# Altium project MB1189.PrjPCB (part 2 of 3)

## Sheet MCU.SchDoc: MCU
size A3; Date: 9/24/2014; Author: P.A.; CompanyName: STMicroelectronics; Organization: Microcontrollers Division; Address1: 12, Rue Jules HOROWITZ; Address2: 38019 Grenoble; Address3: FRANCE; DocumentNumber: MB1189; Revision: B-07; SheetNumber: 4; SheetTotal: 13; Project: STM32F469I-DISCO
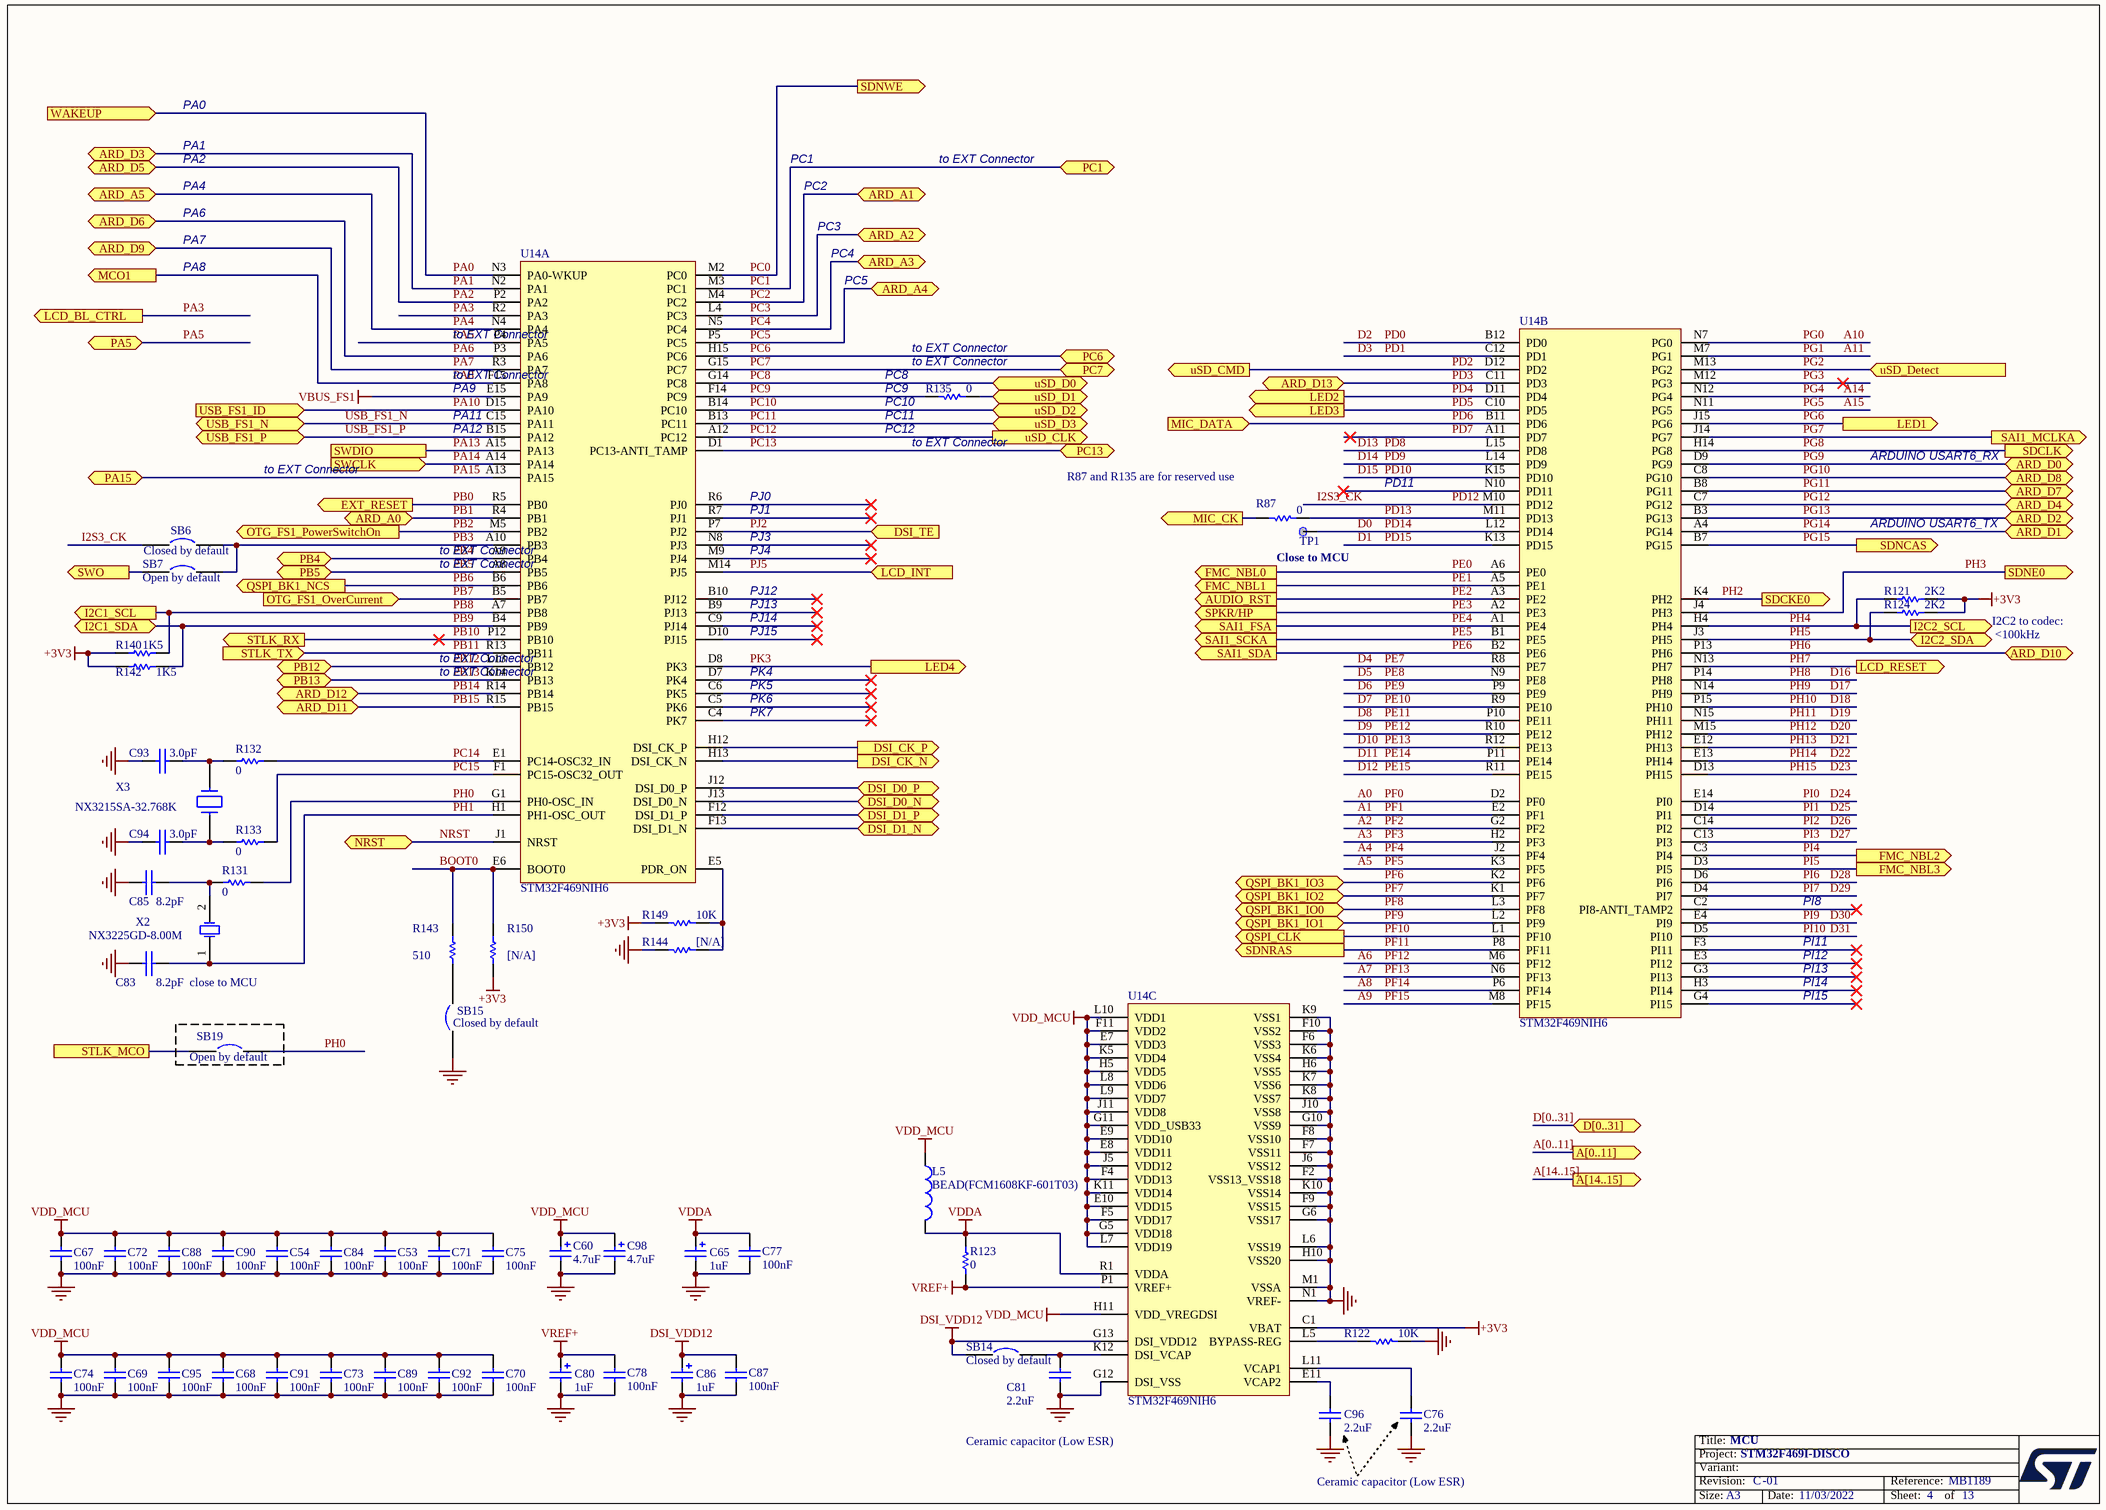
[diagram p6: MCU.SchDoc]

### Parts
C53  100nF  [0402C]
C54  100nF  [0402C]
C60  4.7uF  [CPOL_TAJ-A_1206_H180]
C65  1uF  [CPOL_TAJ-A_1206_H180]
C67  100nF  [0402C]
C68  100nF  [0402C]
C69  100nF  [0402C]
C70  100nF  [0402C]
C71  100nF  [0402C]
C72  100nF  [0402C]
C73  100nF  [0402C]
C74  100nF  [0402C]
C75  100nF  [0402C]
C76  2.2uF  [1206C]
C77  100nF  [0402C]
C78  100nF  [0402C]
C80  1uF  [CPOL_TAJ-A_1206_H180]
C81  2.2uF  [1206C]
C83  8.2pF  [0603C]
C84  100nF  [0402C]
C85  8.2pF  [0603C]
C86  1uF  [CPOL_TAJ-A_1206_H180]
C87  100nF  [0402C]
C88  100nF  [0402C]
C89  100nF  [0402C]
C90  100nF  [0402C]
C91  100nF  [0402C]
C92  100nF  [0402C]
C93  3.0pF  [0603C]
C94  3.0pF  [0603C]
C95  100nF  [0402C]
C96  2.2uF  [1206C]
C98  4.7uF  [CPOL_TAJ-A_1206_H180]
L5  BEAD(FCM1608KF-601T03)  [0603L]
R87  0  [0603R]
R121  2K2  [0603R]
R122  10K  [0402R]
R123  0  [0603R]
R124  2K2  [0603R]
R131  0  [0603R]
R132  0  [0603R]
R133  0  [0603R]
R135  0  [0603R]
R140  1K5  [0603R]
R142  1K5  [0603R]
R143  510  [0603R]
R144  [N/A]  [0603R]
R149  10K  [0402R]
R150  [N/A]  [0603R]
SB6  Closed by default  [SB_0603]
SB7  Open by default  [SB_0603]
SB14  Closed by default  [SB_0603]
SB15  Closed by default  [SB_0603]
SB19  Open by default  [SB_0603]
TP1  TP  [TP_C40]  (value not drawn)
U14  STM32F469NIH6  [BGA216_0R8_13X13]  (parts A,B,C of 3)
X2  NX3225GD-8.00M  [XTAL_2SM_3R2X2R5_H1]
X3  NX3215SA-32.768K  [XTAL_2SM_3R2X1R5]

### Ports
A[0..11] (out), A[14..15] (out), ARD_A0 (bidir), ARD_A1 (bidir), ARD_A2 (bidir), ARD_A3 (bidir), ARD_A4 (bidir), ARD_A5 (bidir), ARD_D0 (bidir), ARD_D1 (bidir), ARD_D2 (bidir), ARD_D3 (bidir), ARD_D4 (bidir), ARD_D5 (bidir), ARD_D6 (bidir), ARD_D7 (bidir), ARD_D8 (bidir), ARD_D9 (bidir), ARD_D10 (bidir), ARD_D11 (bidir), ARD_D12 (bidir), ARD_D13 (bidir), AUDIO_RST (out), D[0..31] (bidir), DSI_CK_N (out), DSI_CK_P (out), DSI_D0_N (bidir), DSI_D0_P (bidir), DSI_D1_N (bidir), DSI_D1_P (bidir), DSI_TE (in), EXT_RESET (out), FMC_NBL0 (out), FMC_NBL1 (out), FMC_NBL2 (out), FMC_NBL3 (out), I2C1_SCL (out), I2C1_SDA (bidir), I2C2_SCL (out), I2C2_SDA (bidir), LCD_BL_CTRL (out), LCD_INT (in), LCD_RESET (out), LED1 (out), LED2 (out), LED3 (out), LED4 (out), MCO1 (out), MIC_CK (out), MIC_DATA (in), NRST (bidir), OTG_FS1_OverCurrent (in), OTG_FS1_PowerSwitchOn (out), PA5 (bidir), PA15 (bidir), PB4 (bidir), PB5 (bidir), PB12 (bidir), PB13 (bidir), PC1 (bidir), PC6 (bidir), PC7 (bidir), PC13 (bidir), QSPI_BK1_IO0 (bidir), QSPI_BK1_IO1 (bidir), QSPI_BK1_IO2 (bidir), QSPI_BK1_IO3 (bidir), QSPI_BK1_NCS (out), QSPI_CLK (out), SAI1_FSA (out), SAI1_MCLKA (out), SAI1_SCKA (out), SAI1_SDA (out), SDCKE0 (out), SDCLK (out), SDNCAS (out), SDNE0 (out), SDNRAS (out), SDNWE (out), SPKR/HP (out), STLK_MCO, STLK_RX (out), STLK_TX (in), SWCLK (in), SWDIO, SWO (out), USB_FS1_ID (in), USB_FS1_N (bidir), USB_FS1_P (bidir), uSD_CLK (out), uSD_CMD (out), uSD_D0 (bidir), uSD_D1 (bidir), uSD_D2 (bidir), uSD_D3 (bidir), uSD_Detect (in), WAKEUP (in)

### Nets
+3V3: R121.1 R124.1 R140.1 R142.1 R149.2 R150.2 U14.C1(VBAT)
DSI_VDD12: C86.1 C87.2 SB14.1 U14.G13(DSI_VDD12)
GND: C53.2 C54.2 C60.2 C65.2 C67.2 C68.2 C69.2 C70.2 C71.2 C72.2 C73.2 C74.2 C75.2 C76.2 C77.1 C78.1 C80.2 C81.2 C83.2 C84.2 C85.2 C86.2 C87.1 C88.2 C89.2 C90.2 C91.2 C92.2 C93.2 C94.2 C95.2 C96.2 C98.2 R122.1 R144.2 SB15.1 U14.F2(VSS13_VSS18) U14.F6(VSS3) U14.F7(VSS11) U14.F8(VSS10) U14.F9(VSS15) U14.F10(VSS2) U14.G6(VSS17) U14.G10(VSS9) U14.G12(DSI_VSS) U14.H6(VSS5) U14.H10(VSS20) U14.J6(VSS12) U14.J10(VSS8) U14.K6(VSS4) U14.K7(VSS6) U14.K8(VSS7) U14.K9(VSS1) U14.K10(VSS14) U14.L6(VSS19) U14.M1(VSSA) U14.N1(VREF-)
VBUS_FS1: U14.E15(PA9)
VDD_MCU: C53.1 C54.1 C60.1 C67.1 C68.1 C69.1 C70.1 C71.1 C72.1 C73.1 C74.1 C75.1 C84.1 C88.1 C89.1 C90.1 C91.1 C92.1 C95.1 C98.1 L5.1 U14.E7(VDD3) U14.E8(VDD11) U14.E9(VDD10) U14.E10(VDD15) U14.F4(VDD13) U14.F5(VDD17) U14.F11(VDD2) U14.G5(VDD18) U14.G11(VDD_USB33) U14.H5(VDD5) U14.H11(VDD_VREGDSI) U14.J5(VDD12) U14.J11(VDD8) U14.K5(VDD4) U14.K11(VDD14) U14.L7(VDD19) U14.L8(VDD6) U14.L9(VDD7) U14.L10(VDD1)
VDDA: C65.1 C77.2 L5.2 R123.1 U14.R1(VDDA)
VREF+: C78.2 C80.1 R123.2 U14.P1(VREF+)
A0: U14.D2(PF0)  [also labelled PF0]
A1: U14.E2(PF1)  [also labelled PF1]
A2: U14.G2(PF2)  [also labelled PF2]
A3: U14.H2(PF3)  [also labelled PF3]
A4: U14.J2(PF4)  [also labelled PF4]
A5: U14.K3(PF5)  [also labelled PF5]
A6: U14.M6(PF12)  [also labelled PF12]
A7: U14.N6(PF13)  [also labelled PF13]
A8: U14.P6(PF14)  [also labelled PF14]
A9: U14.M8(PF15)  [also labelled PF15]
A10: U14.N7(PG0)  [also labelled PG0]
A11: U14.M7(PG1)  [also labelled PG1]
A14: U14.N12(PG4)  [also labelled PG4]
A15: U14.N11(PG5)  [also labelled PG5]
BOOT0: R143.1 R150.1 U14.E6(BOOT0)
D0: TP1.1 U14.L12(PD14)  [also labelled PD14]
D1: U14.K13(PD15)  [also labelled PD15]
D2: U14.B12(PD0)  [also labelled PD0]
D3: U14.C12(PD1)  [also labelled PD1]
D4: U14.R8(PE7)  [also labelled PE7]
D5: U14.N9(PE8)  [also labelled PE8]
D6: U14.P9(PE9)  [also labelled PE9]
D7: U14.R9(PE10)  [also labelled PE10]
D8: U14.P10(PE11)  [also labelled PE11]
D9: U14.R10(PE12)  [also labelled PE12]
D10: U14.R12(PE13)  [also labelled PE13]
D11: U14.P11(PE14)  [also labelled PE14]
D12: U14.R11(PE15)  [also labelled PE15]
D13: U14.L15(PD8)  [also labelled PD8]
D14: U14.L14(PD9)  [also labelled PD9]
D15: U14.K15(PD10)  [also labelled PD10]
D16: U14.P14(PH8)  [also labelled PH8]
D17: U14.N14(PH9)  [also labelled PH9]
D18: U14.P15(PH10)  [also labelled PH10]
D19: U14.N15(PH11)  [also labelled PH11]
D20: U14.M15(PH12)  [also labelled PH12]
D21: U14.E12(PH13)  [also labelled PH13]
D22: U14.E13(PH14)  [also labelled PH14]
D23: U14.D13(PH15)  [also labelled PH15]
D24: U14.E14(PI0)  [also labelled PI0]
D25: U14.D14(PI1)  [also labelled PI1]
D26: U14.C14(PI2)  [also labelled PI2]
D27: U14.C13(PI3)  [also labelled PI3]
D28: U14.D6(PI6)  [also labelled PI6]
D29: U14.D4(PI7)  [also labelled PI7]
D30: U14.E4(PI9)  [also labelled PI9]
D31: U14.D5(PI10)  [also labelled PI10]
HSSI_CLK_N: U14.H13(DSI_CK_N) ; port DSI_CK_N
HSSI_CLK_P: U14.H12(DSI_CK_P) ; port DSI_CK_P
HSSI_D0_N: U14.J13(DSI_D0_N) ; port DSI_D0_N
HSSI_D0_P: U14.J12(DSI_D0_P) ; port DSI_D0_P
HSSI_D1_N: U14.F13(DSI_D1_N) ; port DSI_D1_N
HSSI_D1_P: U14.F12(DSI_D1_P) ; port DSI_D1_P
I2S3_CK: SB6.1 U14.M10(PD12)  [also labelled PD12]
MIC_CK: R87.1 ; port MIC_CK
NRST: U14.J1(NRST) ; port NRST
PA0: U14.N3(PA0-WKUP) ; port WAKEUP
PA1: U14.N2(PA1) ; port ARD_D3
PA2: U14.P2(PA2) ; port ARD_D5
PA3: U14.R2(PA3) ; port LCD_BL_CTRL  [project net LCD_BL_CTRL]
PA4: U14.N4(PA4) ; port ARD_A5
PA5: U14.P4(PA5) ; port PA5
PA6: U14.P3(PA6) ; port ARD_D6
PA7: U14.R3(PA7) ; port ARD_D9
PA8: U14.F15(PA8) ; port MCO1
PA10: U14.D15(PA10) ; port USB_FS1_ID
PA13: U14.A15(PA13) ; port SWDIO
PA14: U14.A14(PA14) ; port SWCLK
PA15: U14.A13(PA15) ; port PA15
PB0: U14.R5(PB0) ; port EXT_RESET
PB1: U14.R4(PB1) ; port ARD_A0
PB2: U14.M5(PB2) ; port OTG_FS1_PowerSwitchOn
PB3: SB6.2 SB7.2 U14.A10(PB3)
PB4: U14.A9(PB4) ; port PB4
PB5: U14.A8(PB5) ; port PB5
PB6: U14.B6(PB6) ; port QSPI_BK1_NCS
PB7: U14.B5(PB7) ; port OTG_FS1_OverCurrent
PB8: R140.2 U14.A7(PB8) ; port I2C1_SCL  [project net I2C1_SCL]
PB9: R142.2 U14.B4(PB9) ; port I2C1_SDA  [project net I2C1_SDA]
PB10: U14.P12(PB10) ; port STLK_RX
PB11: U14.R13(PB11) ; port STLK_TX
PB12: U14.L13(PB12) ; port PB12
PB13: U14.K14(PB13) ; port PB13
PB14: U14.R14(PB14) ; port ARD_D12
PB15: U14.R15(PB15) ; port ARD_D11
PC0: U14.M2(PC0) ; port SDNWE
PC1: U14.M3(PC1) ; port PC1
PC2: U14.M4(PC2) ; port ARD_A1
PC3: U14.L4(PC3) ; port ARD_A2
PC4: U14.N5(PC4) ; port ARD_A3
PC5: U14.P5(PC5) ; port ARD_A4
PC6: U14.H15(PC6) ; port PC6
PC7: U14.G15(PC7) ; port PC7
PC8: U14.G14(PC8) ; port uSD_D0
PC9: R135.1 U14.F14(PC9)
PC10: U14.B14(PC10) ; port uSD_D2
PC11: U14.B13(PC11) ; port uSD_D3
PC12: U14.A12(PC12) ; port uSD_CLK
PC13: U14.D1(PC13-ANTI_TAMP) ; port PC13
PC14: R132.2 U14.E1(PC14-OSC32_IN)
PC15: R133.2 U14.F1(PC15-OSC32_OUT)
PD2: U14.D12(PD2) ; port uSD_CMD
PD3: U14.C11(PD3) ; port ARD_D13
PD4: U14.D11(PD4) ; port LED2
PD5: U14.C10(PD5) ; port LED3
PD6: U14.B11(PD6) ; port MIC_DATA
PD7: U14.A11(PD7)
PD13: R87.2 U14.M11(PD13)
PE0: U14.A6(PE0) ; port FMC_NBL0
PE1: U14.A5(PE1) ; port FMC_NBL1
PE2: U14.A3(PE2) ; port AUDIO_RST  [project net AUDIO_RST]
PE3: U14.A2(PE3) ; port SPKR/HP
PE4: U14.A1(PE4) ; port SAI1_FSA
PE5: U14.B1(PE5) ; port SAI1_SCKA
PE6: U14.B2(PE6) ; port SAI1_SDA
PF6: U14.K2(PF6) ; port QSPI_BK1_IO3
PF7: U14.K1(PF7) ; port QSPI_BK1_IO2
PF8: U14.L3(PF8) ; port QSPI_BK1_IO0
PF9: U14.L2(PF9) ; port QSPI_BK1_IO1
PF10: U14.L1(PF10) ; port QSPI_CLK
PF11: U14.P8(PF11) ; port SDNRAS
PG2: U14.M13(PG2) ; port uSD_Detect
PG3: U14.M12(PG3)
PG6: U14.J15(PG6) ; port LED1
PG7: U14.J14(PG7) ; port SAI1_MCLKA
PG8: U14.H14(PG8) ; port SDCLK
PG9: U14.D9(PG9) ; port ARD_D0
PG10: U14.C8(PG10) ; port ARD_D8
PG11: U14.B8(PG11) ; port ARD_D7
PG12: U14.C7(PG12) ; port ARD_D4
PG13: U14.B3(PG13) ; port ARD_D2
PG14: U14.A4(PG14) ; port ARD_D1
PG15: U14.B7(PG15) ; port SDNCAS
PH0: R131.1 SB19.2 U14.G1(PH0-OSC_IN)
PH1: C83.1 U14.H1(PH1-OSC_OUT) X2.1(OSC1)
PH2: U14.K4(PH2) ; port SDCKE0
PH3: U14.J4(PH3) ; port SDNE0
PH4: R121.2 U14.H4(PH4) ; port I2C2_SCL  [project net I2C2_SCL]
PH5: R124.2 U14.J3(PH5) ; port I2C2_SDA  [project net I2C2_SDA]
PH6: U14.P13(PH6) ; port ARD_D10
PH7: U14.N13(PH7) ; port LCD_RESET  [project net LCD_RST]
PI4: U14.C3(PI4) ; port FMC_NBL2
PI5: U14.D3(PI5) ; port FMC_NBL3
PJ2: U14.P7(PJ2) ; port DSI_TE
PJ5: U14.M14(PJ5) ; port LCD_INT  [project net LCD_INT]
PK3: U14.D8(PK3) ; port LED4
STLK_MCO: SB19.1 ; port STLK_MCO
SWO: SB7.1 ; port SWO
USB_FS1_N: U14.C15(PA11) ; port USB_FS1_N
USB_FS1_P: U14.B15(PA12) ; port USB_FS1_P
uSD_D1: R135.2 ; port uSD_D1
NetC76_1: C76.1 U14.L11(VCAP1)
NetC81_1: C81.1 SB14.2 U14.K12(DSI_VCAP)
NetC85_1: C85.1 R131.2 X2.2(OSC2)
NetC93_1: C93.1 R132.1 X3.1
NetC94_1: C94.1 R133.1 X3.2
NetC96_1: C96.1 U14.E11(VCAP2)
NetR122_2: R122.2 U14.L5(BYPASS-REG)
NetR143_2: R143.2 SB15.2
NetR144_1: R144.1 R149.1 U14.E5(PDR_ON)

Not connected (* = marked no-connect by the designer): U14 B9(PJ13)* B10(PJ12)* C2(PI8-ANTI_TAMP2)* C4(PK7)* C5(PK6)* C6(PK5)* C9(PJ14)* D7(PK4)* D10(PJ15)* E3(PI12)* F3(PI11)* G3(PI13)* G4(PI15)* H3(PI14)* M9(PJ4)* N8(PJ3)* N10(PD11)* R6(PJ0)* R7(PJ1)*

### Buses and harness runs
bus A[0..11] = port A[0..11]
bus A[14..15] = port A[14..15]
bus D[0..31] = port D[0..31]

### Notes on the sheet
- PA0
- PA1
- PA2
- PC1
- to EXT Connector
- PA6
- PA7
- PA4
- PC2
- PC3
- PA8
- PC4
- PC5
- (near R135) PC8
- (near R135) to EXT Connector
- (near U14) PA11
- (near U14) PA12
- (near U14) PA9
- (near R135) PC9
- (near R135) PC10
- (near R135) PC11
- (near R135) PC12
- PJ1
- PJ0
- (near R87) R87 and R135 are for reserved use
- PD11
- ARDUINO USART6_RX
- PJ4
- PJ3
- Close to MCU
- ARDUINO USART6_TX
- PJ15
- PJ13
- PJ12
- PJ14
- I2C2 to codec:
  <100kHz
- PK7
- PK6
- PK5
- PK4
- PI8
- close to MCU
- PI14
- PI13
- PI12
- PI11
- PI15
- Ceramic capacitor (Low ESR)
- Title:
- Project:
- Size:
- Revision:
- Variant:
- A3
- -
- Date:
- Reference:
- Sheet:
- of

### Library data of the parts
C53 C67-C75 C84 C88-C92 C95 = CAP: Capacitor; Manuf_part_1: CC0402KRX7R7BB104; Manuf_1: YAGEO; Ordered by: Subcon; Published: 8-Jun-2000; Revision: July-2002: Re-released for DXP Platform.; Publisher: Altium Limited; Value: 100nF
C54 = CAP: Capacitor; Manuf_Part_1: CC0402KRX7R7BB104; Manuf_1: YAGEO; Ordered by: Subcon; Published: 8-Jun-2000; Revision: July-2002: Re-released for DXP Platform.; Publisher: Altium Limited; Value: 100nF
C60 C98 = Cap_TAJA475K016R: Capacitor, Tantalum, 4.7uF, 16V, 10%, 4ohms, pkg Type_A (3216 metric), T=1.6mm; Manuf_1: AVX; Value: 4.7uF 16V; Revision: July-2002: Re-released for DXP Platform.; Manuf_part_1: TAJA475K016R
C65 C80 C86 = Cap_TAJA105K016RNJ: Capacitor, Tantalum, 1uF, 16V, 10%, 11Ohms, pkg Type_A (3216 metric), T=1.6mm; Manuf_1: AVX; Value: 1uF (16V); Revision: July-2002: Re-released for DXP Platform.; Manuf_part_1: TAJA105K016RNJ
C76 = Cap: Capacitor; Manuf_1: YAGEO; Manuf_part_1: CC1206KKX7R7BB225; Ordered by: Subcon; Published: 8-Jun-2000; Revision: July-2002: Re-released for DXP Platform.; Publisher: Altium Limited; Value: 2.2uF
C77 C78 C87 = Cap: Capacitor; Manuf_part_1: CC0402KRX7R7BB104; Manuf_1: YAGEO; Ordered by: Subcon; Published: 8-Jun-2000; Revision: July-2002: Re-released for DXP Platform.; Publisher: Altium Limited; Value: 100nF
C81 C96 = Cap: Capacitor; Manuf_part_1: CC1206KKX7R7BB225; Manuf_1: YAGEO; Ordered by: Subcon; Published: 8-Jun-2000; Revision: July-2002: Re-released for DXP Platform.; Publisher: Altium Limited; Value: 2.2uF
C83 C85 = CAP: Capacitor; Manuf_part_1: CC0603CRNPO9BN8R2; Manuf_1: YAGEO; Ordered by: Subcon; Value: 8.2pF
C93 C94 = CAP: Capacitor; Manuf_1: YAGEO; Manuf_part_1: CC0603CRNPO9BN3R0; Ordered by: Subcon
  C93: Value: 3.0pF
  C94: value: 3.0pF
L5 = Inductor: Manuf_1: Tai-Tech Advanced Electronics; Manuf_part_1: FCM1608KF-601T05; Value: 100uH; Ordered by: Subcon; Published: 8-Jun-2000; Revision: July-2002: Re-released for DXP Platform.; Publisher: Altium Limited
R87 R123 R131-R133 R135 = Res1: Resistor; Manuf_1: YAGEO; Manuf_part_1: RC0603JR-070RL; Ordered by: Subcon; Published: 8-Jun-2000; Revision: July-2002: Re-released for DXP Platform.; Publisher: Altium Limited; Value: 0
R121 R124 = Res1: Resistor; Manuf_1: YAGEO; Manuf_part_1: RC0603FR-072K2L; Ordered by: Subcon; Published: 8-Jun-2000; Revision: July-2002: Re-released for DXP Platform.; Publisher: Altium Limited
  R121: Value: 2K2
  R124: Value: 2k2
R122 R149 = Res1: Resistor; Manuf_1: YAGEO; Manuf_part_1: RC0402FR-0710KL; Ordered by: Subcon; Published: 8-Jun-2000; Revision: July-2002: Re-released for DXP Platform.; Publisher: Altium Limited; Value: 10K
R140 R142 = Res1: Resistor; Manuf_1: YAGEO; Manuf_part_1: RC0603FR-071K5L; Ordered by: Subcon; Published: 8-Jun-2000; Revision: July-2002: Re-released for DXP Platform.; Publisher: Altium Limited; Value: 1K5
R143 = res1: Resistor; Manuf_1: YAGEO; Manuf_part_1: RC0603FR-07510RL; Ordered by: Subcon; Published: 8-Jun-2000; Revision: July-2002: Re-released for DXP Platform.; Publisher: Altium Limited; Value: 510
R144 = Res1: Resistor; Value: 1K; Ordered by: Subcon; Fitted: NO; Published: 8-Jun-2000; Revision: July-2002: Re-released for DXP Platform.; Publisher: Altium Limited
R150 = res1: Resistor; Value: 1K; Ordered by: Subcon; Fitted: NO; Published: 8-Jun-2000; Revision: July-2002: Re-released for DXP Platform.; Publisher: Altium Limited
SB6 SB14 SB15 = Circuit Breaker: Ordered by: Subcon; Comments: Solder bridge; Published: 24-Mar-1999; Revision: July-2002: Re-released for DXP Platform.; Publisher: Altium Limited
  SB6: ECCN_US/EU: n/a
SB7 SB19 = Circuit Breaker: Ordered by: Subcon; Comments: Solder bridge; Solder: NO; Published: 24-Mar-1999; Revision: July-2002: Re-released for DXP Platform.; Publisher: Altium Limited
TP1 = TP: Ordered by: Subcon
U14 = Manta_Dragon_TFBGA216: Manuf_Part_1: STM32F469NIH6U cut 1.0; Ordered by: ST; Ref St: 9175177; ECCN_US/EU: 3A991A2/NEC; Manuf_1: ST
X2 = XTAL_8M_NX3225GD: Crystal 8Mhz, 8pF, -+50PPM, SMD; Manuf_1: NDK; Manuf_Part_1: NX3225GD 8MHz EXS00A-CG04874; Manuf_Part_2: NX3225GD-8.000M-STD-CRA-3; ECCN_US/EU: EAR99/NEC; NDK Ref: X3127326; Ref St: 9157029; Provided: ST; Order: NX3225GD 8MHz EXS00A-CG04874; Ordered by: ST
X3 = XTAL_32K_NX3215SA: Crystal 32.768kHz, 6pF, -+20PPM, R=50K, SMD; Manuf_1: NDK; Manuf_Part_1: NX3215SA 32.768KHz EXS00A-MU00525; ECCN_US/EU: EAR99/NEC; Ref St: 9157034; NDK Ref: X3101802; Provided: ST; Distrib: *; Order: NX3215SA 32.768KHz EXS00A-MU00525; Ordered by: ST

## Sheet Arduino_ Connectors.SchDoc: Arduino Uno connector
size A4; Date: 9/24/2014; Author: P.A.; CompanyName: STMicroelectronics; Organization: Microcontrollers Division; Address1: 12, Rue Jules HOROWITZ; Address2: 38019 Grenoble; Address3: FRANCE; DocumentNumber: MB1189; Revision: B-07; SheetNumber: 12; SheetTotal: 13; Project: STM32F469I-DISCO
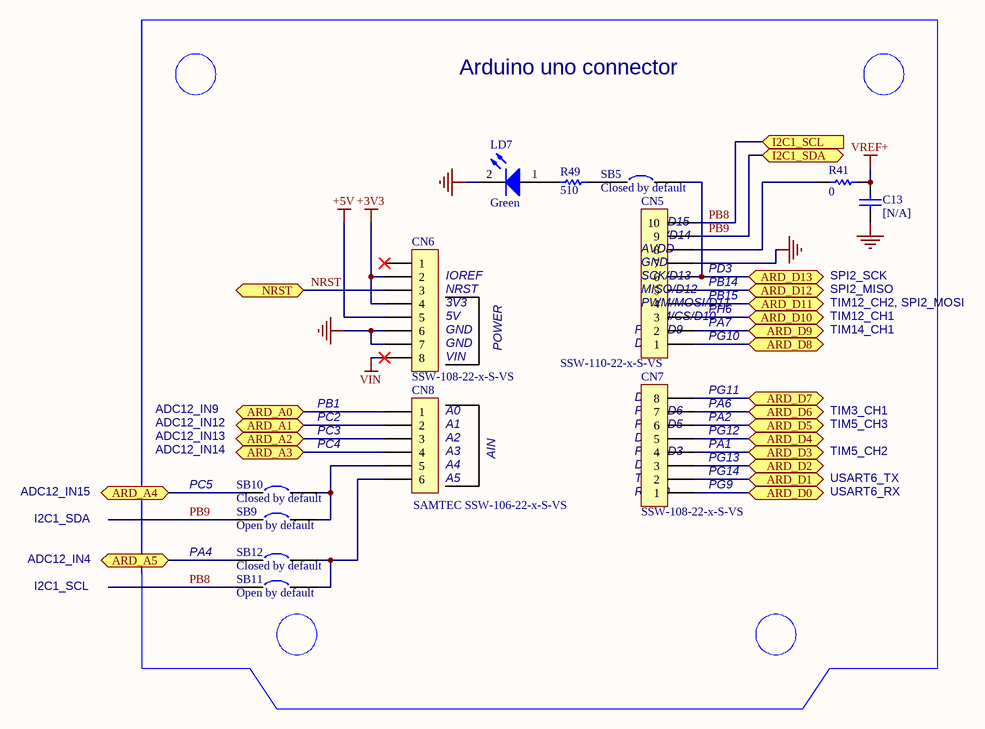
[diagram p7: Arduino_ Connectors.SchDoc]

### Parts
C13  [N/A]  [0603C]
CN5  SSW-110-22-x-S-VS  [SSW-110-22-X-S-VS]
CN6  SSW-108-22-x-S-VS  [SSW-108-22-X-S-VS]
CN7  SSW-108-22-x-S-VS  [SSW-108-22-X-S-VS]
CN8  SAMTEC SSW-106-22-x-S-VS  [SSW-106-22-X-S-VS]
LD7  Green  [0603D]
R41  0  [0603R]
R49  510  [0603R]
SB5  Closed by default  [SB_0603]
SB9  Open by default  [SB_0603]
SB10  Closed by default  [SB_0603]
SB11  Open by default  [SB_0603]
SB12  Closed by default  [SB_0603]

### Ports
ARD_A0 (bidir), ARD_A1 (bidir), ARD_A2 (bidir), ARD_A3 (bidir), ARD_A4 (bidir), ARD_A5 (bidir), ARD_D0 (bidir), ARD_D1 (bidir), ARD_D2 (bidir), ARD_D3 (bidir), ARD_D4 (bidir), ARD_D5 (bidir), ARD_D6 (bidir), ARD_D7 (bidir), ARD_D8 (bidir), ARD_D9 (bidir), ARD_D10 (bidir), ARD_D11 (bidir), ARD_D12 (bidir), ARD_D13 (bidir), I2C1_SCL (in), I2C1_SDA (bidir), NRST (bidir)

### Nets
+3V3: CN6.2 CN6.4
+5V: CN6.5
GND: C13.1 CN5.7 CN6.6 CN6.7 LD7.2(K)
VIN: CN6.8
VREF+: C13.2 R41.1
NRST: CN6.3 ; port NRST
PA1: CN7.4 ; port ARD_D3
PA2: CN7.6 ; port ARD_D5
PA4: SB12.1 ; port ARD_A5
PA6: CN7.7 ; port ARD_D6
PA7: CN5.2 ; port ARD_D9
PB1: CN8.1 ; port ARD_A0
PB8: CN5.10 SB11.1 ; port I2C1_SCL  [project net I2C1_SCL]
PB9: CN5.9 SB9.1 ; port I2C1_SDA  [project net I2C1_SDA]
PB14: CN5.5 ; port ARD_D12
PB15: CN5.4 ; port ARD_D11
PC2: CN8.2 ; port ARD_A1
PC3: CN8.3 ; port ARD_A2
PC4: CN8.4 ; port ARD_A3
PC5: SB10.1 ; port ARD_A4
PD3: CN5.6 SB5.2 ; port ARD_D13
PG9: CN7.1 ; port ARD_D0
PG10: CN5.1 ; port ARD_D8
PG11: CN7.8 ; port ARD_D7
PG12: CN7.5 ; port ARD_D4
PG13: CN7.3 ; port ARD_D2
PG14: CN7.2 ; port ARD_D1
PH6: CN5.3 ; port ARD_D10
NetCN5_8: CN5.8 R41.2
NetCN8_5: CN8.5 SB9.2 SB10.2
NetCN8_6: CN8.6 SB11.2 SB12.2
NetLD7_1: LD7.1(A) R49.2
NetR49_1: R49.1 SB5.1

Not connected (* = marked no-connect by the designer): CN6 1*

### Notes on the sheet
- Arduino uno connector
- (near CN5) SDA/D14
- SCL/D15
- (near CN5) AVDD
- (near CN6) IOREF
- (near CN6) NRST
- (near CN6) 3V3
- (near CN5) SCK/D13
- (near CN5) MISO/D12
- (near CN5) PWM/MOSI/D11
- (near CN5) GND
- (near CN5) PH6
- (near CN5) PB15
- (near CN5) PB14
- (near CN5) PD3
- TIM12_CH2, SPI2_MOSI
- SPI2_MISO
- SPI2_SCK
- (near CN6) 5V
- (near CN6) GND
- (near CN6) VIN
- POWER
- (near CN5) D8
- (near CN5) PWM/D9
- (near CN5) PWM/CS/D10
- (near CN5) PG10
- (near CN5) PA7
- TIM14_CH1
- TIM12_CH1
- ADC12_IN14
- ADC12_IN13
- ADC12_IN12
- ADC12_IN9
- PB1
- PC2
- PC3
- PC4
- (near CN8) A0
- (near CN8) A1
- (near CN8) A2
- (near CN7) D4
- (near CN7) PWM/D5
- (near CN7) PWM/D6
- (near CN7) D7
- (near CN7) PA1
- (near CN7) PG12
- (near CN7) PA2
- (near CN7) PA6
- PG11
- TIM5_CH3
- TIM3_CH1
- ADC12_IN15
- I2C1_SDA
- PC5
- (near CN8) A3
- (near CN8) A4
- (near CN8) A5
- AIN
- (near CN7) RX/D0
- (near CN7) TX/D1
- (near CN7) D2
- (near CN7) PWM/D3
- (near CN7) PG9
- (near CN7) PG14
- (near CN7) PG13
- USART6_RX
- USART6_TX
- TIM5_CH2
- ADC12_IN4
- PA4
- I2C1_SCL
- Title:
- Project:
- Size:
- Revision:
- Variant:
- -
- Date:
- Reference:
- Sheet:
- of

### Library data of the parts
C13 = Cap: Capacitor; Value: 10nF; Ordered by: Subcon; Fitted: NO; Published: 8-Jun-2000; Revision: July-2002: Re-released for DXP Platform.; Publisher: Altium Limited
CN5 = Header 10X1_Female: Header, 10-Pin, Single row,female; Manuf_1: SAMTEC; Ordered by: Subcon; Silkscreen: pin names as in schematic; LatestRevisionDate: 17-Jul-2002; LatestRevisionNote: Re-released for DXP Platform.; Publisher: Altium Limited; Manuf_Part_1: SSW-110-22-x-S-VS
CN6 CN7 = Header 8X1_Female: Header, 8-Pin, Single row,female; Manuf_1: SAMTEC; Ordered by: Subcon; Silkscreen: pin names as in schematic; LatestRevisionDate: 17-Jul-2002; LatestRevisionNote: Re-released for DXP Platform.; Publisher: Altium Limited; Manuf_Part_1: SSW-108-22-x-S-VS
CN8 = Header 6X1_Female: Header, 6-Pin, Single row,female SMD; Ordered by: Subcon; Silkscreen: pin names as in schematic; LatestRevisionDate: 17-Jul-2002; LatestRevisionNote: Re-released for DXP Platform.; Publisher: Altium Limited; Manuf_1: SAMTEC; Manuf_Part_1: SSW-106-22-x-S-VS
LD7 = LED2: Typical RED, GREEN, YELLOW, AMBER GaAs LED; Manuf_1: Everlight Electronics; Manuf_part_1: 19-217/G7C-AN1P2/3T; Ordered by: Subcon; ECCN_US/EU: EAR99/NEC; Published: 8-Jun-2000; Revision: July-2002: Re-released for DXP Platform.; Publisher: Altium Limited
R41 = Res1: as R87 on sheet MCU; Published: 8-Jun-2000; Revision: July-2002: Re-released for DXP Platform.; Publisher: Altium Limited; Value: 0
R49 = Res1: Resistor; Manuf_1: YAGEO; Manuf_part_1: RC0603FR-07510RL; Ordered by: Subcon; Published: 8-Jun-2000; Revision: July-2002: Re-released for DXP Platform.; Publisher: Altium Limited; Value: 510
SB5 SB10 SB12 = Circuit Breaker: as SB6 on sheet MCU; Published: 24-Mar-1999; Revision: July-2002: Re-released for DXP Platform.; Publisher: Altium Limited
SB9 SB11 = Circuit Breaker: as SB7 on sheet MCU; Published: 24-Mar-1999; Revision: July-2002: Re-released for DXP Platform.; Publisher: Altium Limited

## Sheet DSI_LCD.SchDoc: 4 inch DSI LCD board
size A4; Date: 9/24/2014; Author: P.A.; CompanyName: STMicroelectronics; Organization: Microcontrollers Division; Address1: 12, Rue Jules HOROWITZ; Address2: 38019 Grenoble; Address3: FRANCE; DocumentNumber: MB1189; Revision: B-07; SheetNumber: 7; SheetTotal: 13; Project: STM32F469I-DISCO
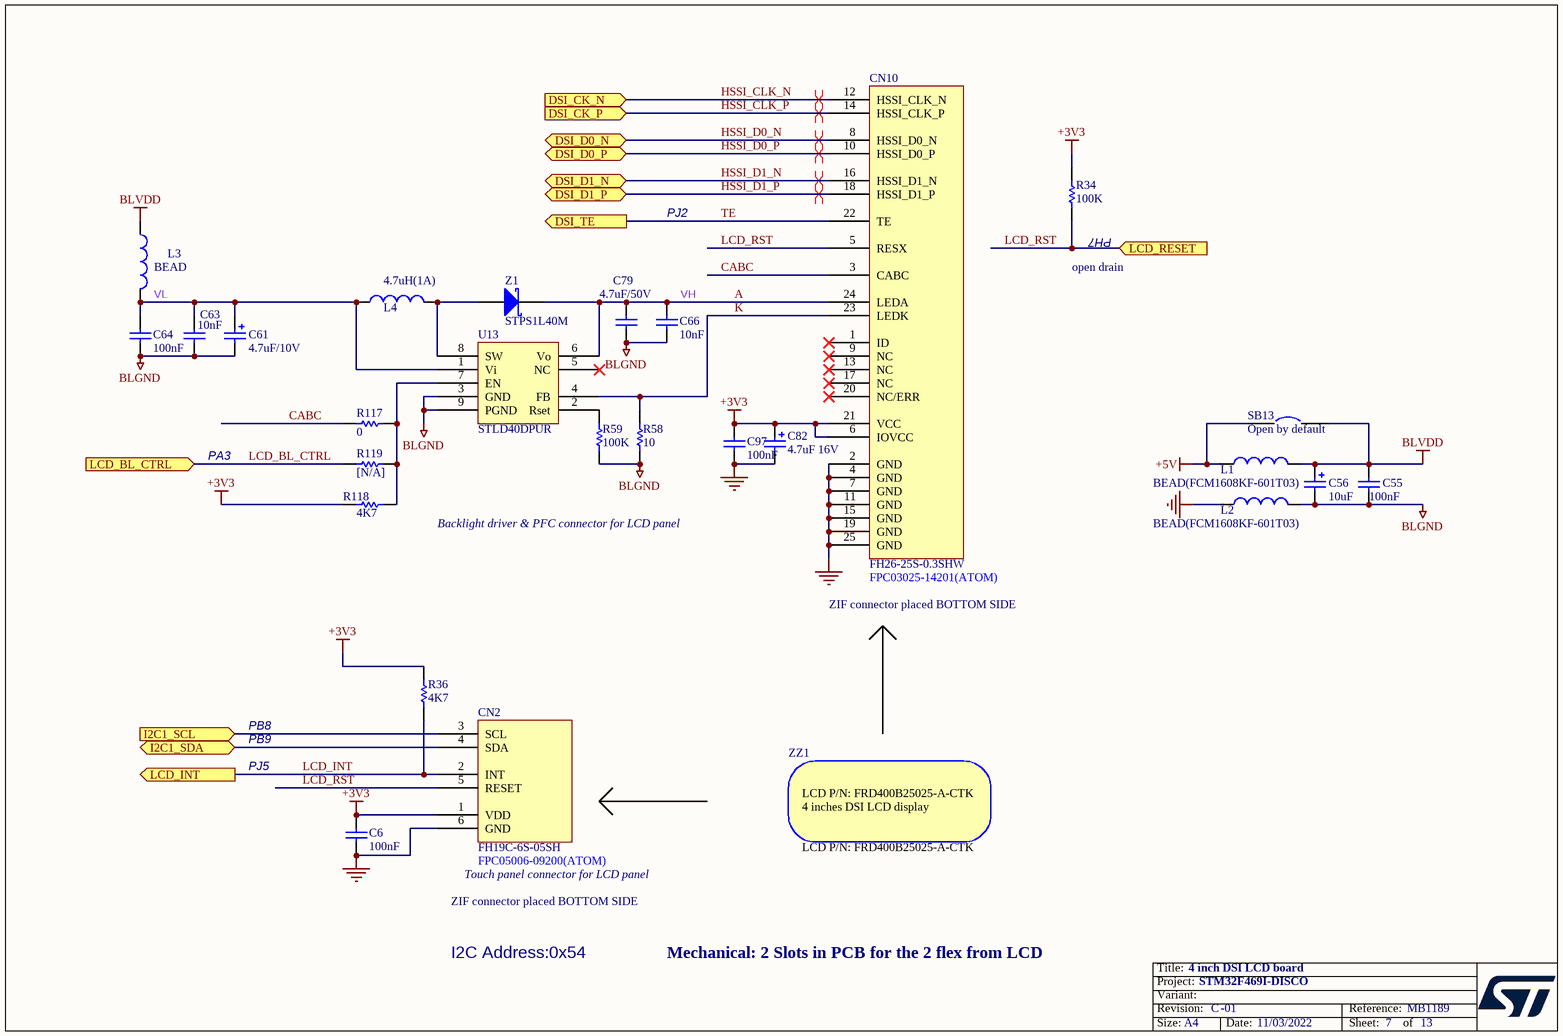
[diagram p8: DSI_LCD.SchDoc]

### Parts
C6  100nF  [0402C]
C55  100nF  [0402C]
C56  10uF  [CPOL_TAJ-A_1206_H180]
C61  4.7uF/10V  [1206C]
C63  10nF  [0603C]
C64  100nF  [0402C]
C66  10nF  [0603C]
C79  4.7uF/50V  [1206C]
C82  4.7uF 16V  [CPOL_TAJ-A_1206_H180]
C97  100nF  [0402C]
CN2  FH19C-6S-05SH  [FH19C-6S-0R5SH_FPC_CPT]
CN10  FH26-25S-0.3SHW  [FPC25_FPC03025-1420]
L1  BEAD(FCM1608KF-601T03)  [0603L]
L2  BEAD(FCM1608KF-601T03)  [0603L]
L3  BEAD  [0603L]
L4  4.7uH(1A)  [1210L]
R34  100K  [0402R]
R36  4K7  [0603R]
R58  10  [0603R]
R59  100K  [0603R]
R117  0  [0603R]
R118  4K7  [0603R]
R119  [N/A]  [0603R]
SB13  Open by default  [SB_0603]
U13  STLD40DPUR  [SON8_0R65_3X3]
Z1  STPS1L40M  [DO-216AA]
ZZ1  LCD P/N: FRD400B25025-A-CTK  [toto]  (mechanical)

### Ports
DSI_CK_N (in), DSI_CK_P (in), DSI_D0_N (bidir), DSI_D0_P (bidir), DSI_D1_N (bidir), DSI_D1_P (bidir), DSI_TE (out), I2C1_SCL (in), I2C1_SDA (bidir), LCD_BL_CTRL (in), LCD_INT (out), LCD_RESET (in)

### Nets
+3V3: C6.2 C82.1 C97.2 CN2.1(VDD) CN10.6(IOVCC) CN10.21(VCC) R34.1 R36.1 R118.2
+5V: L1.1 SB13.1
BLGND: C55.2 C56.2 C61.2 C63.1 C64.1 C66.1 C79.2 L2.2 R58.1 R59.2 U13.3(GND) U13.9(PGND)
BLVDD: C55.1 C56.1 L1.2 L3.1 SB13.2
GND: C6.1 C82.2 C97.1 CN2.6(GND) CN10.2(GND) CN10.4(GND) CN10.7(GND) CN10.11(GND) CN10.15(GND) CN10.19(GND) CN10.25(GND) L2.1
A: C66.2 C79.1 CN10.24(LEDA) U13.6(Vo) Z1.2(K)  [also labelled VH]
CABC: CN10.3(CABC) R117.2
HSSI_CLK_N: CN10.12(HSSI_CLK_N) ; port DSI_CK_N
HSSI_CLK_P: CN10.14(HSSI_CLK_P) ; port DSI_CK_P
HSSI_D0_N: CN10.8(HSSI_D0_N) ; port DSI_D0_N
HSSI_D0_P: CN10.10(HSSI_D0_P) ; port DSI_D0_P
HSSI_D1_N: CN10.16(HSSI_D1_N) ; port DSI_D1_N
HSSI_D1_P: CN10.18(HSSI_D1_P) ; port DSI_D1_P
I2C1_SCL: CN2.3(SCL) ; port I2C1_SCL
I2C1_SDA: CN2.4(SDA) ; port I2C1_SDA
K: CN10.23(LEDK) R58.2 U13.4(FB)
LCD_BL_CTRL: R119.2 ; port LCD_BL_CTRL
LCD_INT: CN2.2(INT) R36.2 ; port LCD_INT
LCD_RST: CN2.5(RESET) CN10.5(RESX) R34.2 ; port LCD_RESET
TE: CN10.22(TE) ; port DSI_TE  [project net PJ2]
VL: C61.1 C63.2 C64.2 L3.2 L4.1 U13.1(Vi)
NetL4_2: L4.2 U13.8(SW) Z1.1(A)
NetR59_1: R59.1 U13.2(Rset)
NetR117_1: R117.1 R118.1 R119.1 U13.7(EN)

Not connected (* = marked no-connect by the designer): CN10 1(ID)* 9(NC)* 13(NC)* 17(NC)* 20(NC/ERR)*; U13 5(NC)*

### Layout directives
differential pair: HSSI_CLK_N, HSSI_CLK_P, HSSI_D0_N, HSSI_D0_P, HSSI_D1_N, HSSI_D1_P

### Notes on the sheet
- PJ2
- (near R34) PH7
- open drain
- PA3
- Backlight driver & PFC connector for LCD panel
- (near CN10) FPC03025-14201(ATOM)
- ZIF connector placed BOTTOM SIDE
- PB9
- PB8
- PJ5
- (near CN2) Touch panel connector for LCD panel
- (near CN2) FPC05006-09200(ATOM)
- I2C Address:0x54
- Mechanical: 2 Slots in PCB for the 2 flex from LCD
- Title:
- Project:
- Size:
- Revision:
- Variant:
- A4
- -
- Date:
- Reference:
- Sheet:
- of

### Library data of the parts
C6 C64 C97 = CAP: as C53 on sheet MCU; Published: 8-Jun-2000; Revision: July-2002: Re-released for DXP Platform.; Publisher: Altium Limited
  C6 C64: Value: 100nF
  C97: Value: 100NF
C55 = Cap: as C77 on sheet MCU; Published: 8-Jun-2000; Revision: July-2002: Re-released for DXP Platform.; Publisher: Altium Limited; Value: 100nF
C56 = Cap_TAJA106K016R: Capacitor, Tantalum, 10uF, 16V, 10%, 3Ohms, pkg Type_A (3216 metric), T=1.6mm; Manuf_1: AVX; Value: 10uF (16V); Revision: July-2002: Re-released for DXP Platform.; Manuf_part_1: TAJA106K016R
C61 = Cap Pol1: Polarized Capacitor (Radial); Manuf_part_1: CC1206KKX7R8BB475; Manuf_1: YAGEO; Value: 4.7uF; Ordered by: Subcon; Published: 8-Jun-2000; Revision: July-2002: Re-released for DXP Platform.; Publisher: Altium Limited
C63 C66 = CAP: Capacitor; Manuf_part_1: CC0603KRX7R9BB103; Manuf_1: YAGEO; Ordered by: Subcon; Published: 8-Jun-2000; Revision: July-2002: Re-released for DXP Platform.; Publisher: Altium Limited; Value: 10nF
C79 = CAP: Capacitor; Manuf_part_1: CC1206KKX7R9BB475; Manuf_1: YAGEO; Value: 4.7uF; Ordered by: Subcon; Published: 8-Jun-2000; Revision: July-2002: Re-released for DXP Platform.; Publisher: Altium Limited
C82 = Cap_TAJA475K016R: Capacitor, Tantalum, 4.7uF, 16V, 10%, 4ohms, pkg Type_A (3216 metric), T=1.6mm; Manuf_1: AVX; Revision: July-2002: Re-released for DXP Platform.; Value: 4.7uF 16V; Manuf_part_1: TAJA475K016R
CN2 = FH19C-6S-05SH: ZIF connector placed bottom side; Manuf_1: ATOM; Manuf_2: Hirose; Manuf_Part_1: FPC05006-09200; Ordered by: Subcon; Silkscreen: TS; Manuf_Part_2: FH19C-6S-05SH
CN10 = FH26-25S-0.3SHW: ZIF connector placed bottom side; Manuf_1: ATOM; Manuf_Part_1: FPC03025-14201; Manuf_2: Hirose; Ordered by: Subcon; Comments: Hirose FH26-25S-0.3SHW; Silkscreen: DSI LCD; Manuf_Part_2: FH26-25S-0.3SHW
L1-L3 = Inductor: as L5 on sheet MCU; Published: 8-Jun-2000; Revision: July-2002: Re-released for DXP Platform.; Publisher: Altium Limited
L4 = Inductor: Manuf_part_1: LQH32PN4R7NN0L; Manuf_1: Murata Manufacturing; Ordered by: Subcon; Published: 8-Jun-2000; Revision: July-2002: Re-released for DXP Platform.; Publisher: Altium Limited; Value: 4.7uH
R34 = Res1: Resistor; Manuf_part_1: RC0402FR-07100KL; Manuf_1: YAGEO; Ordered by: Subcon; Published: 8-Jun-2000; Revision: July-2002: Re-released for DXP Platform.; Publisher: Altium Limited; Value: 100K
R36 R118 = Res1: Resistor; Manuf_1: YAGEO; Manuf_part_1: RC0603FR-074K7L; Ordered by: Subcon; Published: 8-Jun-2000; Revision: July-2002: Re-released for DXP Platform.; Publisher: Altium Limited
  R36: Value: 4k7
  R118: Value: 4K7
R58 = Res1: Resistor; Manuf_1: YAGEO; Manuf_part_1: RC0603FR-0710RL; Ordered by: Subcon; Published: 8-Jun-2000; Revision: July-2002: Re-released for DXP Platform.; Publisher: Altium Limited; Value: 10
R59 = Res1: Resistor; Manuf_1: YAGEO; Manuf_part_1: RC0603FR-07100KL; Ordered by: Subcon; Published: 8-Jun-2000; Revision: July-2002: Re-released for DXP Platform.; Publisher: Altium Limited; Value: 100K
R117 = Res1: as R87 on sheet MCU; Published: 8-Jun-2000; Revision: July-2002: Re-released for DXP Platform.; Publisher: Altium Limited; Value: 0
R119 = Res1: as R144 on sheet MCU; Published: 8-Jun-2000; Revision: July-2002: Re-released for DXP Platform.; Publisher: Altium Limited
SB13 = Circuit Breaker: as SB7 on sheet MCU; Published: 24-Mar-1999; Revision: July-2002: Re-released for DXP Platform.; Publisher: Altium Limited
U13 = STLD40DPMR: Ordered by: ST; Ref St: 9176009; ECCN_US/EU: EAR99/NEC; Manuf_1: ST; Manuf_Part_1: STLD40DPUR
Z1 = D Schottky: Schottky Diode; Code - JEDEC: DO-214-AA; Ordered by: ST; Ref St: 9151085; ECCN_US/EU: EAR99/NEC; Published: 8-Jun-2000; Revision: July-2002: Re-released for DXP Platform.; Publisher: Altium Limited; Manuf_1: ST; Manuf_Part_1: STPS1L40M
ZZ1 = LCD: 4 inches DSI LCD with touch screen; Manuf_1: Techshine; Manuf_Part_1: TS-P0400022A; Ordered by: Subcon; Comments: 4 inches DSI LCD display; ECCN_US/EU: EAR99/NEC; Value: TS-P0400022A

## Sheet QSPI.SchDoc: QSPI
size A4; Date: 9/24/2014; Author: P.A.; CompanyName: STMicroelectronics; Organization: Microcontrollers Division; Address1: 12, Rue Jules HOROWITZ; Address2: 38019 Grenoble; Address3: FRANCE; DocumentNumber: MB1189; Revision: B-07; SheetNumber: 6; SheetTotal: 13; Project: STM32F469I-DISCO
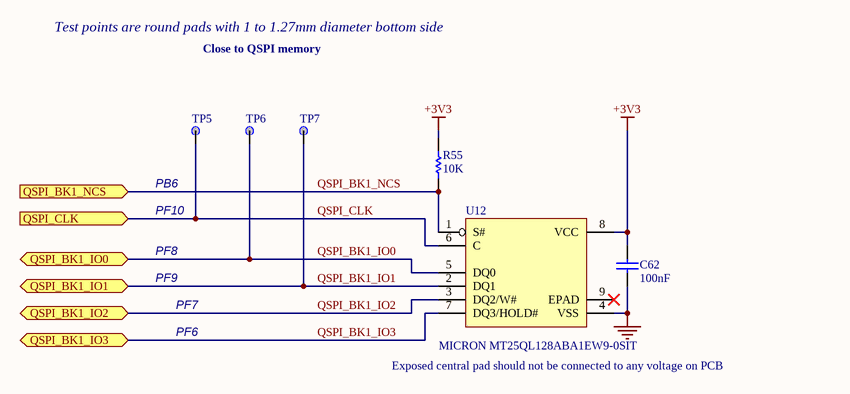
[diagram p9: QSPI.SchDoc]

### Parts
C62  100nF  [0402C]
R55  10K  [0402R]
TP5  TP  [TP_C40]  (value not drawn)
TP6  TP  [TP_C40]  (value not drawn)
TP7  TP  [TP_C40]  (value not drawn)
U12  MICRON MT25QL128ABA1EW9-0SIT  [ICC_W-PDFN-8_8X6_P127]

### Ports
QSPI_BK1_IO0 (bidir), QSPI_BK1_IO1 (bidir), QSPI_BK1_IO2 (bidir), QSPI_BK1_IO3 (bidir), QSPI_BK1_NCS (in), QSPI_CLK (in)

### Nets
+3V3: C62.1 R55.2 U12.8(VCC)
GND: C62.2 U12.4(VSS)
QSPI_BK1_IO0: TP6.1 U12.5(DQ0) ; port QSPI_BK1_IO0  [project net PF8]
QSPI_BK1_IO1: TP7.1 U12.2(DQ1) ; port QSPI_BK1_IO1  [project net PF9]
QSPI_BK1_IO2: U12.3(DQ2/W#) ; port QSPI_BK1_IO2  [project net PF7]
QSPI_BK1_IO3: U12.7(DQ3/HOLD#) ; port QSPI_BK1_IO3  [project net PF6]
QSPI_BK1_NCS: R55.1 U12.1(S#) ; port QSPI_BK1_NCS  [project net PB6]
QSPI_CLK: TP5.1 U12.6(C) ; port QSPI_CLK  [project net PF10]

Not connected (* = marked no-connect by the designer): U12 9(EPAD)*

### Notes on the sheet
- Test points are round pads with 1 to 1.27mm diameter bottom side
- Close to QSPI memory
- (near TP5) PB6
- PF10
- PF8
- PF9
- PF7
- PF6
- (near U12) Exposed central pad should not be connected to any voltage on PCB
- Title:
- Project:
- Size:
- Revision:
- Variant:
- A4
- -
- Date:
- Reference:
- Sheet:
- of

### Library data of the parts
C62 = Cap: as C77 on sheet MCU; Published: 8-Jun-2000; Revision: July-2002: Re-released for DXP Platform.; Publisher: Altium Limited; Value: 100nF
R55 = Res_10K_1%_0402: Resistor; Manuf_Part_1: RC0402FR-0710KL; Manuf_1: YAGEO; Ordered by: Subcon; Value: 10K; Order: RC0402FR-0710KL; ECCN_US/EU: n/a
TP5-TP7 = TP: Ordered by: Subcon
U12 = MT25QL128ABA1EW9-0SIT: 128Mb, 3V, Multiple I/O Serial Flash Memory, Quad/Dual; ECCN_US/EU: 3A991/NEC; Ref St: 9171975; Manuf_1: MICRON; Manuf_Part_1: MT25QL128ABA1EW9-0SIT; Value: MT25QL128ABA1EW9-0SIT

## Sheet AUDIO2.SchDoc: Audio Codec and Microphone MEMS
size A4; Date: 9/24/2014; Author: P.A.; CompanyName: STMicroelectronics; Organization: Microcontrollers Division; Address1: 12, Rue Jules HOROWITZ; Address2: 38019 Grenoble; Address3: FRANCE; DocumentNumber: MB1189; Revision: B-07; SheetNumber: 9; SheetTotal: 13; Project: STM32F469I-DISCO
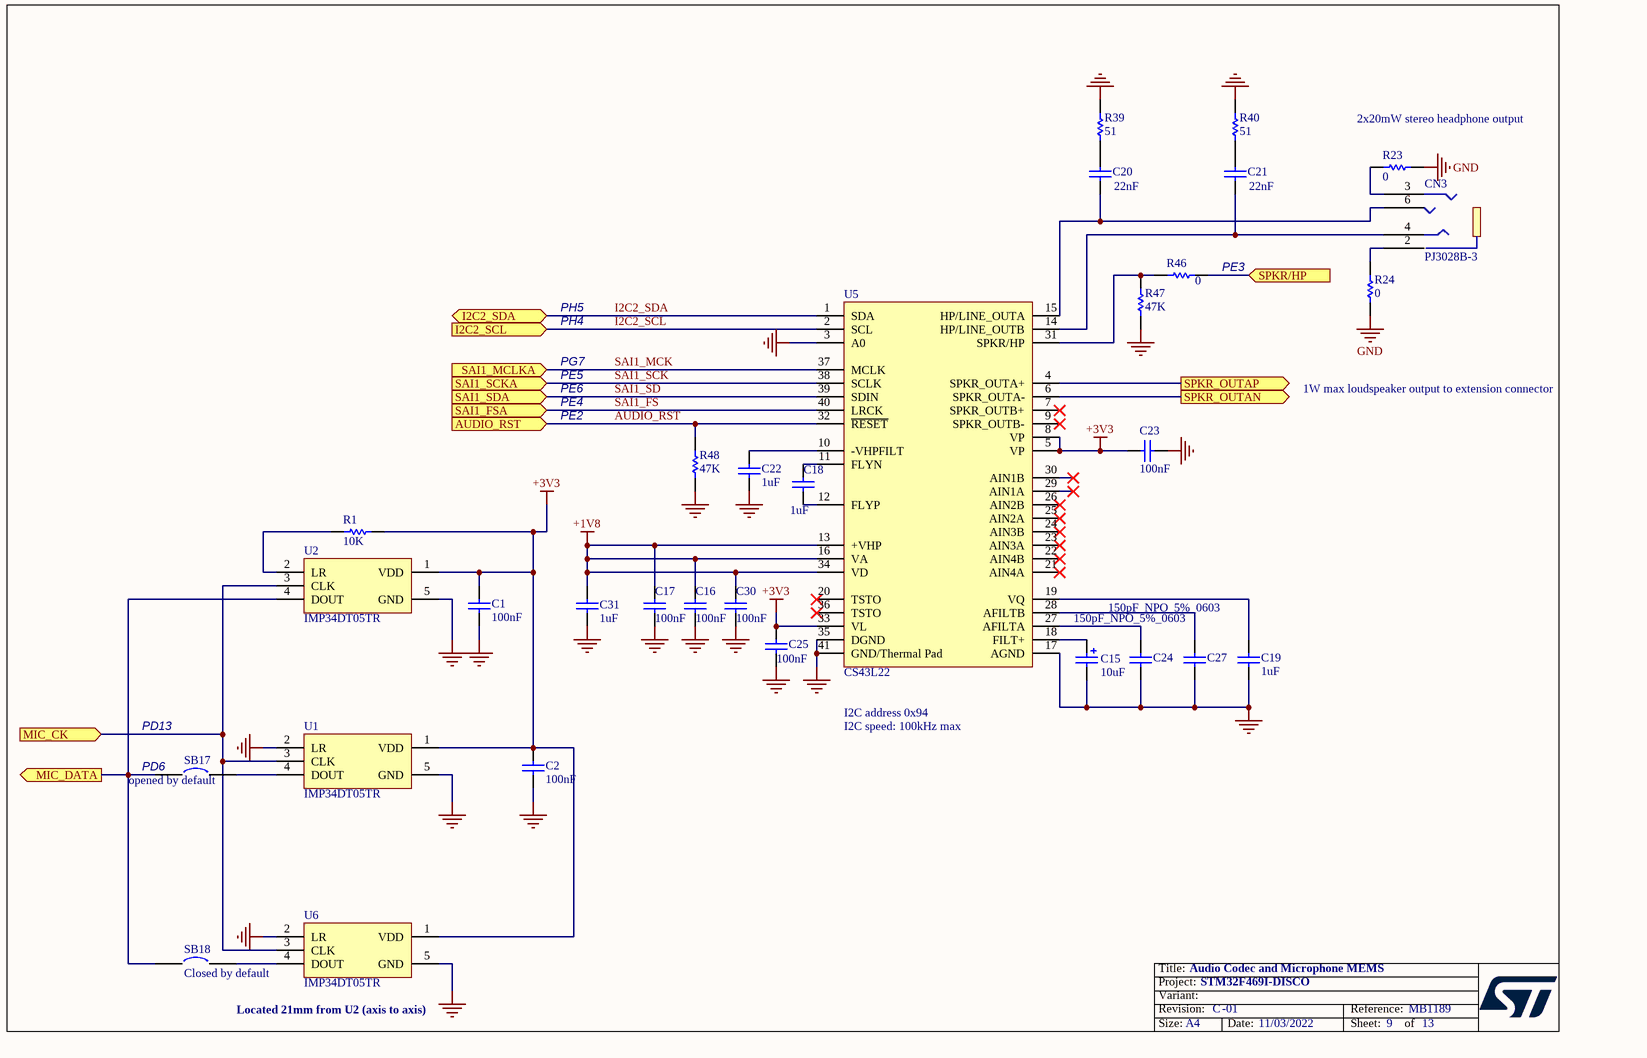
[diagram p10: AUDIO2.SchDoc]

### Parts
C1  100nF  [0402C]
C2  100nF  [0402C]
C15  10uF  [CPOL_TAJ-A_1206_H180]
C16  100nF  [0402C]
C17  100nF  [0402C]
C18  1uF  [0603C]
C19  1uF  [0603C]
C20  22nF  [0603C]
C21  22nF  [0603C]
C22  1uF  [0603C]
C23  100nF  [0402C]
C24  150pF_NPO_5%_0603  [0603C]
C25  100nF  [0402C]
C27  150pF_NPO_5%_0603  [0603C]
C30  100nF  [0402C]
C31  1uF  [0603C]
CN3  PJ3028B-3  [PJ3028B]
R1  10K  [0603R]
R23  0  [0603R]
R24  0  [0603R]
R39  51  [0402R]
R40  51  [0402R]
R46  0  [0603R]
R47  47K  [0603R]
R48  47K  [0603R]
SB17  opened by default  [SB_0603]
SB18  Closed by default  [SB_0603]
U1  IMP34DT05TR  [MIC_HCLGA_3X4X1_4LD_]
U2  IMP34DT05TR  [MIC_HCLGA_3X4X1_4LD_]
U5  CS43L22  [QFN40_0R5_6X6]
U6  IMP34DT05TR  [MIC_HCLGA_3X4X1_4LD_]

### Ports
AUDIO_RST (in), I2C2_SCL (in), I2C2_SDA (bidir), MIC_CK (in), MIC_DATA (out), SAI1_FSA (in), SAI1_MCLKA (in), SAI1_SCKA (in), SAI1_SDA (in), SPKR/HP (in), SPKR_OUTAN (out), SPKR_OUTAP (out)

### Nets
+1V8: C16.1 C17.1 C30.1 C31.1 U5.13(+VHP) U5.16(VA) U5.34(VD)
+3V3: C1.2 C2.2 C23.2 C25.1 R1.2 U1.1(VDD) U2.1(VDD) U5.5(VP) U5.8(VP) U5.33(VL) U6.1(VDD)
GND: C1.1 C2.1 C15.2 C16.2 C17.2 C19.1 C22.1 C23.1 C24.1 C25.2 C27.1 C30.2 C31.2 R23.2 R24.2 R39.2 R40.2 R47.2 R48.1 U1.2(LR) U1.5(GND) U2.5(GND) U5.3(A0) U5.17(AGND) U5.35(DGND) U5.41(GND/Thermal_Pad) U6.2(LR) U6.5(GND)
AUDIO_RST: R48.2 U5.32(~{RESET}) ; port AUDIO_RST
I2C2_SCL: U5.2(SCL) ; port I2C2_SCL
I2C2_SDA: U5.1(SDA) ; port I2C2_SDA
MIC_CK: U1.3(CLK) U2.3(CLK) U6.3(CLK) ; port MIC_CK
PD6: SB17.2 SB18.2 U2.4(DOUT) ; port MIC_DATA
PE3: R46.2 ; port SPKR/HP
SAI1_FS: U5.40(LRCK) ; port SAI1_FSA  [project net PE4]
SAI1_MCK: U5.37(MCLK) ; port SAI1_MCLKA  [project net PG7]
SAI1_SCK: U5.38(SCLK) ; port SAI1_SCKA  [project net PE5]
SAI1_SD: U5.39(SDIN) ; port SAI1_SDA  [project net PE6]
SPKR_OUTAN: U5.6(SPKR_OUTA-) ; port SPKR_OUTAN
SPKR_OUTAP: U5.4(SPKR_OUTA+) ; port SPKR_OUTAP
NetC15_1: C15.1 U5.18(FILT+)
NetC18_1: C18.1 U5.11(FLYN)
NetC18_2: C18.2 U5.12(FLYP)
NetC19_2: C19.2 U5.19(VQ)
NetC20_1: C20.1 CN3.6 U5.15(HP/LINE_OUTA)
NetC20_2: C20.2 R39.1
NetC21_1: C21.1 CN3.4 U5.14(HP/LINE_OUTB)
NetC21_2: C21.2 R40.1
NetC22_2: C22.2 U5.10(-VHPFILT)
NetC24_2: C24.2 U5.27(AFILTA)
NetC27_2: C27.2 U5.28(AFILTB)
NetCN3_2: CN3.2 R24.1
NetCN3_3: CN3.3 R23.1
NetR1_1: R1.1 U2.2(LR)
NetR46_1: R46.1 R47.1 U5.31(SPKR/HP)
NetSB17_1: SB17.1 U1.4(DOUT)
NetSB18_1: SB18.1 U6.4(DOUT)

Not connected (* = marked no-connect by the designer): U5 7(SPKR_OUTB+)* 9(SPKR_OUTB-)* 20(TSTO)* 21(AIN4A)* 22(AIN4B)* 23(AIN3A)* 24(AIN3B)* 25(AIN2A)* 26(AIN2B)* 29(AIN1A)* 30(AIN1B)* 36(TSTO)*

### Notes on the sheet
- (near R23) 2x20mW stereo headphone output
- PH5
- (near R46) PE3
- PE5
- PG7
- PH4
- PE6
- PE4
- PE2
- 1W max loudspeaker output to extension connector
- I2C address 0x94
- (near SB17) PD13
- (near SB17) PD6
- I2C speed: 100kHz max
- Located 21mm from U2 (axis to axis)
- Title:
- Project:
- Size:
- Revision:
- Variant:
- A4
- -
- Date:
- Reference:
- Sheet:
- of

### Library data of the parts
C1 C2 = Cap: as C77 on sheet MCU; Published: 8-Jun-2000; Revision: July-2002: Re-released for DXP Platform.; Publisher: Altium Limited; Value: 100nF
C15 = Cap_TAJA106K016R: as C56 on sheet DSI_LCD; Revision: July-2002: Re-released for DXP Platform.; Manuf_part_1: TAJA106K016R
C16 C23 C25 C30 = CAP: as C53 on sheet MCU; Published: 8-Jun-2000; Revision: July-2002: Re-released for DXP Platform.; Publisher: Altium Limited; Value: 100nF
C17 = CAP: as C54 on sheet MCU; Published: 8-Jun-2000; Revision: July-2002: Re-released for DXP Platform.; Publisher: Altium Limited; Value: 100NF
C18 C22 C31 = CAP: Capacitor; Manuf_part_1: CC0603KRX5R7BB105; Manuf_1: YAGEO; Ordered by: Subcon; Published: 8-Jun-2000; Revision: July-2002: Re-released for DXP Platform.; Publisher: Altium Limited; Value: 1uF
C19 = CAP: Capacitor; Manuf_1: YAGEO; Manuf_part_1: CC0603KRX5R7BB105; Ordered by: Subcon; Published: 8-Jun-2000; Revision: July-2002: Re-released for DXP Platform.; Publisher: Altium Limited; Value: 1uF
C20 C21 = Cap_22nF_X7R_10%_0603: Capacitor,22nF,50V,X7R,10%,0603,YAGEO; Manuf_Part_1: CC0603KRX7R9BB223; Ordered by: Subcon; Revision: July-2002: Re-released for DXP Platform.; Value: 22nF; Order: CC0603KRX7R9BB223; Manuf_1: YAGEO; ECCN_US/EU: n/a
C24 C27 = Cap_150pF_NPO_5%_0603: Capacitor,150pF,50V,NPO,5%,0603,YAGEO; Order: CC0603JRNPO9BN151; Ordered by: Subcon; Revision: July-2002: Re-released for DXP Platform.; Value: 150pF; Manuf_1: YAGEO; Manuf_Part_1: CC0603JRNPO9BN151; ECCN_US/EU: n/a
CN3 = PJ3028B-3: Manuf_1: QIAOD; Ordered by: Subcon; Silkscreen: AUDIO JACK; Manuf_Part_1: PJ3028B-3
R1 = Res_0_5%_0402: Resistor; Manuf_Part_1: RC0603FR-0710KL; Manuf_1: YAGEO; Order: 2363467; Ordered by: Subcon; Value: 10k; ECCN_US/EU: n/a; Distrib: FARNELL
R23 R24 R46 = Res1: as R87 on sheet MCU; Published: 8-Jun-2000; Revision: July-2002: Re-released for DXP Platform.; Publisher: Altium Limited; Value: 0
R39 R40 = Res_51_1%_0402: Resistor; Manuf_Part_1: RC0402FR-0751RL; Manuf_1: YAGEO; Order: 311-51.0LRTR-ND; Ordered by: Subcon; Value: 51; ECCN_US/EU: n/a; Distrib: DIGIKEY
R47 R48 = Res1: Resistor; Manuf_1: YAGEO; Manuf_part_1: RC0603FR-0747KL; Ordered by: Subcon; Published: 8-Jun-2000; Revision: July-2002: Re-released for DXP Platform.; Publisher: Altium Limited; Value: 47K
SB17 = Circuit Breaker: Ordered by: Subcon; Comments: Solder bridge; solder: NO; Published: 24-Mar-1999; Revision: July-2002: Re-released for DXP Platform.; Publisher: Altium Limited
SB18 = Circuit Breaker: as SB6 on sheet MCU; Published: 24-Mar-1999; Revision: July-2002: Re-released for DXP Platform.; Publisher: Altium Limited
U1 U2 U6 = IMP34DT05TR: MEMS audio sensor omnidirectional digital microphone for industrial applications; Ordered by: ST; Ref St: 9177995; ECCN_US/EU: EAR99/NEC; Publisher: Altium Limited; Manuf_1: ST; Manuf_Part_1: IMP34DT05TR; Value: IMP34DT05TR
U5 = CS43L22: Low Power, Stereo DAC w/Headphone & Speaker Amps; Manuf_1: Cirrus; Order: CS43L22-CNZ; ECCN_US/EU: EAR99/NEC; Ordered by: Subcon; Manuf_Part_1: CS43L22-CNZ; Distrib: DIGIKEY

## Sheet USB_OTG_FS.SchDoc: USB_OTG_FS
size A4; Date: 9/24/2014; Author: P.A.; CompanyName: STMicroelectronics; Organization: Microcontrollers Division; Address1: 12, Rue Jules HOROWITZ; Address2: 38019 Grenoble; Address3: FRANCE; DocumentNumber: MB1189; Revision: B-07; SheetNumber: 8; SheetTotal: 13; Project: STM32F469I-DISCO
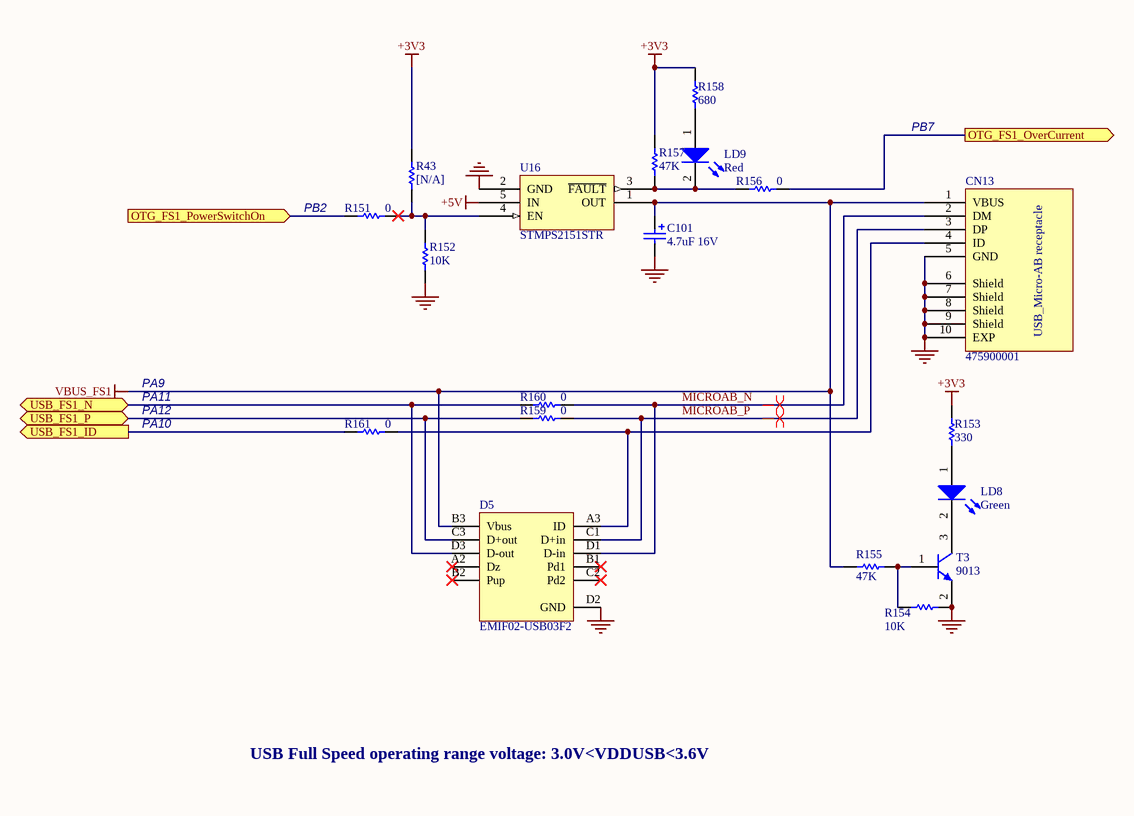
[diagram p11: USB_OTG_FS.SchDoc]

### Parts
C101  4.7uF 16V  [CPOL_TAJ-A_1206_H180]
CN13  475900001  [MOLEX_47590001]
D5  EMIF02-USB03F2  [BGA11_0R5_1R57X2R07]
LD8  Green  [0603D]
LD9  Red  [0603D]
R43  [N/A]  [0603R]
R151  0  [0603R]
R152  10K  [0402R]
R153  330  [0603R]
R154  10K  [0603R]
R155  47K  [0603R]
R156  0  [0603R]
R157  47K  [0603R]
R158  680  [0603R]
R159  0  [0603R]
R160  0  [0603R]
R161  0  [0603R]
T3  9013  [SOT-23]
U16  STMPS2151STR  [SOT23-5]

### Ports
OTG_FS1_OverCurrent (out), OTG_FS1_PowerSwitchOn (in), USB_FS1_ID (out), USB_FS1_N (bidir), USB_FS1_P (bidir)

### Nets
+3V3: R43.1 R153.2 R157.1 R158.2
+5V: U16.5(IN)
GND: C101.2 CN13.5(GND) CN13.6(Shield) CN13.7(Shield) CN13.8(Shield) CN13.9(Shield) CN13.10(EXP) D5.D2(GND) R152.1 R154.1 T3.2(E) U16.2(GND)
VBUS_FS1: C101.1 CN13.1(VBUS) D5.B3(Vbus) R155.1 U16.1(OUT)
MICROAB_N: CN13.2(DM) D5.D1(D-in) R160.1
MICROAB_P: CN13.3(DP) D5.C1(D+in) R159.1
PA10: R161.2 ; port USB_FS1_ID
PB2: R151.2 ; port OTG_FS1_PowerSwitchOn
PB7: R156.1 ; port OTG_FS1_OverCurrent
USB_FS1_N: D5.D3(D-out) R160.2 ; port USB_FS1_N
USB_FS1_P: D5.C3(D+out) R159.2 ; port USB_FS1_P
NetCN13_4: CN13.4(ID) D5.A3(ID) R161.1
NetLD8_1: LD8.1(A) R153.1
NetLD8_2: LD8.2(K) T3.3(C)
NetLD9_1: LD9.1(A) R158.1
NetLD9_2: LD9.2(K) R156.2 R157.2 U16.3(~{FAULT})
NetR43_2: R43.2 R151.1 R152.2 U16.4(EN)
NetR154_2: R154.2 R155.2 T3.1(B)

Not connected (* = marked no-connect by the designer): D5 A2(Dz)* B1(Pd1)* B2(Pup)* C2(Pd2)*

### Layout directives
differential pair: MICROAB_N, MICROAB_P

### Notes on the sheet
- PB7
- (near R151) PB2
- PA9
- PA10
- PA11
- PA12
- USB Full Speed operating range voltage: 3.0V<VDDUSB<3.6V
- Title:
- Project:
- Size:
- Revision:
- Variant:
- A4
- -
- Date:
- Reference:
- Sheet:
- of
- (in symbol 475900001) USB_Micro-AB receptacle

### Library data of the parts
C101 = Cap_TAJA475K016R: as C82 on sheet DSI_LCD; Revision: July-2002: Re-released for DXP Platform.; Value: 4.7uF 16V; Manuf_part_1: TAJA475K016R
CN13 = 475900001: Manuf_1: MOLEX; Ordered by: Subcon; Silkscreen: USB USER; Manuf_Part_1: 475900001
D5 = EMIF02-USB03F2: 2-line IPAD, EMI filter including ESD protection; Manuf_1: ST; ECCN_US/EU: EAR99/NEC; Ref St: 9179037; Order: EMIF02-USB03F2; Manuf_Part_1: EMIF02-USB03F2; Provided: ST; Distrib: ST; Ordered by: ST
LD8 = LED2: Typical RED, GREEN, YELLOW, AMBER GaAs LED; Manuf_1: Everlight Electronics; Manuf_part_1: 19-217/G7C-AN1P2/3T; Ordered by: Subcon; ECCN_US/EU: EAR99/NEC; Silkscreen: VBUS; Published: 8-Jun-2000; Revision: July-2002: Re-released for DXP Platform.; Publisher: Altium Limited
LD9 = LED2: Typical RED, GREEN, YELLOW, AMBER GaAs LED; Manuf_1: Everlight Electronics; Manuf_part_1: 19-217/R6C-AL1M2VY/3T; Ordered by: Subcon; ECCN_US/EU: EAR99/NEC; Silkscreen: FAULT; Published: 8-Jun-2000; Revision: July-2002: Re-released for DXP Platform.; Publisher: Altium Limited; Parameter 1: *
R43 = Res1: as R144 on sheet MCU; Published: 8-Jun-2000; Revision: July-2002: Re-released for DXP Platform.; Publisher: Altium Limited
R151 R156 R159 R161 = Res1: as R87 on sheet MCU; Published: 8-Jun-2000; Revision: July-2002: Re-released for DXP Platform.; Publisher: Altium Limited; Value: 0
R152 = Res1: as R122 on sheet MCU; Published: 8-Jun-2000; Revision: July-2002: Re-released for DXP Platform.; Publisher: Altium Limited; Value: 10K
R153 = res1: Resistor; Manuf_part_1: RC0603FR-07330RL; Manuf_1: YAGEO; Ordered by: Subcon; Published: 8-Jun-2000; Revision: July-2002: Re-released for DXP Platform.; Publisher: Altium Limited; Value: 330
R154 = res1: Resistor; Manuf_1: YAGEO; Manuf_part_1: RC0603FR-0710KL; Ordered by: Subcon; Published: 8-Jun-2000; Revision: July-2002: Re-released for DXP Platform.; Publisher: Altium Limited; Value: 10K
R155 R157 = res1: Resistor; Manuf_1: YAGEO; Manuf_part_1: RC0603FR-0747KL; Ordered by: Subcon; Published: 8-Jun-2000; Revision: July-2002: Re-released for DXP Platform.; Publisher: Altium Limited; Value: 47K
R158 = Res1: Resistor; Manuf_1: YAGEO; Manuf_part_1: RC0603FR-07680RL; Ordered by: Subcon; Published: 8-Jun-2000; Revision: July-2002: Re-released for DXP Platform.; Publisher: Altium Limited; Value: 680
R160 = Res1: Resistor; Manuf_1: YAGEO; Manuf_Part_1: RC0603JR-070RL; Ordered by: Subcon; Published: 8-Jun-2000; Revision: July-2002: Re-released for DXP Platform.; Publisher: Altium Limited; Value: 0
T3 = NPN: NPN Bipolar Transistor; Manuf_Part_1: MMBT9013; Code - JEDEC: TO-226-AA; Ordered by: Subcon; ECCN_US/EU: EAR99/NEC; Published: 8-Jun-2000; Revision: July-2002: Re-released for DXP Platform.; Publisher: Altium Limited
U16 = STMPS2141STR: Ordered by: ST; Ref St: 9159009; ECCN_US/EU: EAR99/NEC; Manuf_1: ST; Manuf_Part_1: STMPS2151STR

## Sheet ExtensionConnector.SchDoc: Extension Connectors
size A4; Date: 9/24/2014; Author: P.A.; CompanyName: STMicroelectronics; Organization: Microcontrollers Division; Address1: 12, Rue Jules HOROWITZ; Address2: 38019 Grenoble; Address3: FRANCE; DocumentNumber: MB1189; Revision: B-07; SheetNumber: 13; SheetTotal: 13; Project: STM32F469I-DISCO
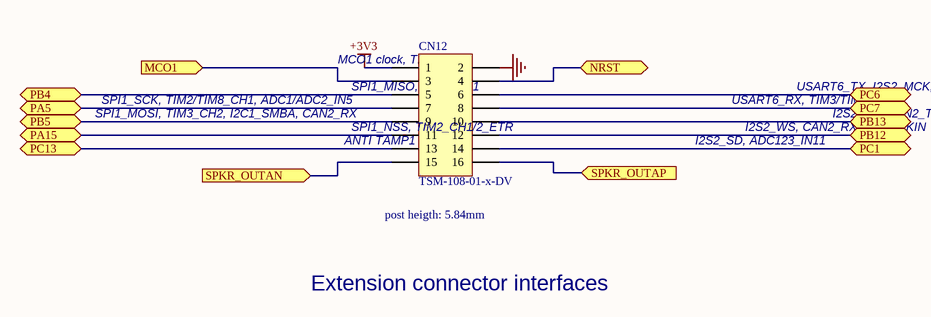
[diagram p12: ExtensionConnector.SchDoc]

### Parts
CN12  TSM-108-01-x-DV  [TSM-108-01-X-DV]

### Ports
MCO1 (in), NRST (bidir), PA5 (bidir), PA15 (bidir), PB4 (bidir), PB5 (bidir), PB12 (bidir), PB13 (bidir), PC1 (bidir), PC6 (bidir), PC7 (bidir), PC13 (bidir), SPKR_OUTAN (in), SPKR_OUTAP (in)

### Nets
+3V3: CN12.1
GND: CN12.2
NRST: CN12.4 ; port NRST
PA5: CN12.7 ; port PA5
PA8: CN12.3 ; port MCO1
PA15: CN12.11 ; port PA15
PB4: CN12.5 ; port PB4
PB5: CN12.9 ; port PB5
PB12: CN12.12 ; port PB12
PB13: CN12.10 ; port PB13
PC1: CN12.14 ; port PC1
PC6: CN12.6 ; port PC6
PC7: CN12.8 ; port PC7
PC13: CN12.13 ; port PC13
SPKR_OUTAN: CN12.15 ; port SPKR_OUTAN
SPKR_OUTAP: CN12.16 ; port SPKR_OUTAP

### Notes on the sheet
- MCO1 clock, TIM1_CH1
- SPI1_MISO, TIM3_CH1
- USART6_TX, I2S2_MCK, TIM3/TIM8_CH1
- SPI1_MOSI, TIM3_CH2, I2C1_SMBA, CAN2_RX
- SPI1_SCK, TIM2/TIM8_CH1, ADC1/ADC2_IN5
- ANTI TAMP1
- SPI1_NSS, TIM2_CH1/2_ETR
- I2S2_SD, ADC123_IN11
- USART6_RX, TIM3/TIM8_CH2
- I2S2_WS, CAN2_RX, TIM1_BKIN
- I2S2_CK, CAN2_TX, USART3_CTS, TIM1_CH1N
- (near CN12) post heigth: 5.84mm
- Extension connector interfaces
- Title:
- Project:
- Size:
- Revision:
- Variant:
- A4
- -
- Date:
- Reference:
- Sheet:
- of

### Library data of the parts
CN12 = Header 8X2: Header, 8-Pin, Dual row; Manuf_1: SAMTEC; Ordered by: Subcon; Silkscreen: EXT; LatestRevisionDate: 17-Jul-2002; LatestRevisionNote: Re-released for DXP Platform.; Publisher: Altium Limited; Manuf_Part_1: TSM-108-01-x-DV